# Altium schematic sheet Relay.SchDoc
size A4
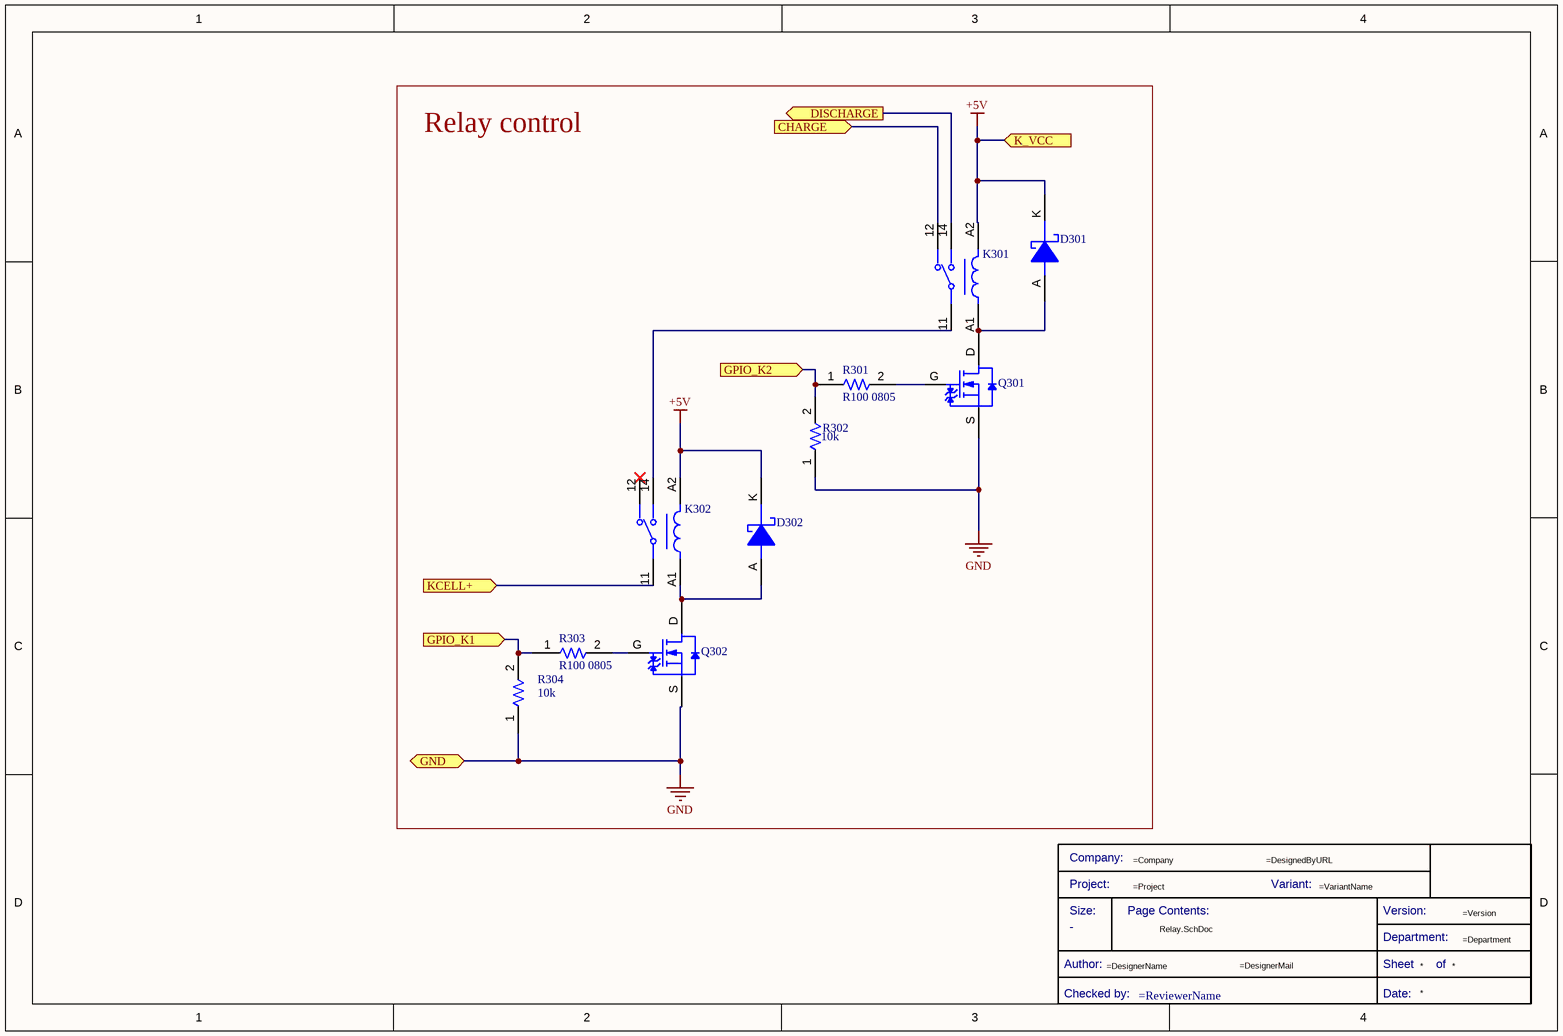
[diagram p0: Relay.SchDoc]

## Parts
*  Title Block_template  (value not drawn)  (graphical)
D301  DSC-0.5/30-SOD123  [DSC-SOD123]  (value not drawn)
D302  DSC-0.5/30-SOD123  [DSC-SOD123]  (value not drawn)
K301  Relay_RZ01-1C4-D005  [FP-1415899-7-MFG]  (value not drawn)
K302  Relay_RZ01-1C4-D005  [FP-1415899-7-MFG]  (value not drawn)
Q301  SQ2318CES-T1_GE3  [SOT95P245X110-3N]  (value not drawn)
Q302  SQ2318CES-T1_GE3  [SOT95P245X110-3N]  (value not drawn)
R301  R100 0805  [R0805FTK]
R302  value 10k  [R0805FTK]  (hidden comment: R10k-0805FTK)
R303  R100 0805  [R0805FTK]
R304  value 10k  [R0805FTK]  (hidden comment: R10k-0805FTK)

## Blocks framed on the sheet
Relay control: D301 D302 K301 K302 Q301 Q302 R301-R304

## Ports
CHARGE (in), DISCHARGE (out), GND (bidir), GPIO_K1 (in), GPIO_K2 (in), K_VCC (in), KCELL+ (in)

## Nets
+5V: D301.K D302.K K301.A2 K302.A2 ; port K_VCC
GND: Q301.S Q302.S R302.1 R304.1 ; port GND
CHARGE: K301.12 ; port CHARGE
DISCHARGE: K301.14 ; port DISCHARGE
GPIO_K1: R303.1 R304.2 ; port GPIO_K1
GPIO_K2: R301.1 R302.2 ; port GPIO_K2
KCELL+: K302.11 ; port KCELL+
NetD301_A: D301.A K301.A1 Q301.D
NetD302_A: D302.A K302.A1 Q302.D
NetK301_11: K301.11 K302.14
NetQ301_G: Q301.G R301.2
NetQ302_G: Q302.G R303.2

Not connected (* = marked no-connect by the designer): K302 12*

## Notes on the sheet
- (in symbol Title Block_template) Company:; Project:; Variant:; Size:; Page Contents:; Version:; Department:; Author:; Sheet; of; Checked by:; Date:

## Library data of the parts
* = Title Block_template: Standard Title Block; .Creator: GP; Category: Title Block; .PCBcheck: GP; .SCHcheck: GP; Checked by:: =ReviewerName; Size: -
D301 D302 = CMP-00165-2: VR=30V IF=500mA 30pF P=410mW; Peak Non-Repetitive Surge Current: 5.5A; .Creator: GP; Voltage Rating (DC): 30V; Current Rating: 500mA; Max Reverse Leakage Current: 130uA; Element Configuration: Single; Polarity: Standard; Forward Voltage: 430mV; ComponentLink5Description: https://datasheet.ciiva.com/910/mbr0530-910516.pdf?src-supplier=Digi-Key; ComponentLink2Description: Where buy it; ComponentLink1Description: Datasheet; Pricing 1: 1=0,34400, 10=0,23900, 100=0,12200, 500=0,10000 (USD); ComponentLink7Description: https://datasheet.ciiva.com/8300/mbr0530-8300905.pdf?src-supplier=Avnet; ComponentLink3URL: https://datasheet.ciiva.com/30479/0900766b810e2512-30479401.pdf?src-supplier=RSComponents; Stock 1: 9; Max Reverse Voltage (DC): 30V; Max Repetitive Reverse Voltage (Vrrm): 30V; Width: 1.6mm; ComponentLink6URL: https://datasheet.ciiva.com/25931/mbr0530-25931989.pdf?src-supplier=Avnet+Europe; Contact Plating: Tin,Matte; Height: 1.03mm; Category: Diode; ComponentLink1URL: *; Max Surge Current: 5.5A; ComponentLink4URL: https://datasheet.ciiva.com/34301/974753-34301826.pdf?src-supplier=Jameco; ComponentLink4Description: https://datasheet.ciiva.com/34301/974753-34301826.pdf?src-supplier=Jameco; ComponentLink5URL: https://datasheet.ciiva.com/910/mbr0530-910516.pdf?src-supplier=Digi-Key; Length: 2.7mm; ComponentLink10URL: https://datasheet.ciiva.com/910/mbr0530-910518.pdf?src-supplier=Digi-Key; ComponentLink2URL: *; ComponentLink7URL: https://datasheet.ciiva.com/8300/mbr0530-8300905.pdf?src-supplier=Avnet; Max Forward Surge Current (Ifsm): 5.5A; Design Item ID: DSC-0.5/30-SOD123; REACH SVHC: No SVHC; Package Quantity: 1; RoHS Compliant: Yes; Lead Free: Lead Free; Max Reverse Current: 130uA; ComponentLink8Description: https://datasheet.ciiva.com/17318/mbr0530-17318568.pdf?src-supplier=Future+Electronics; Series: -; Average Rectified Current: 500mA; Source: Filter components.SchLib; Output Current: 500mA; ComponentLink9URL: https://datasheet.ciiva.com/15144/getdatasheetpartid-86760-15144598.pdf?src-supplier=Verical; Weight: 0.03g; ComponentLink6Description: https://datasheet.ciiva.com/25931/mbr0530-25931989.pdf?src-supplier=Avnet+Europe; ComponentLink9Description: https://datasheet.ciiva.com/15144/getdatasheetpartid-86760-15144598.pdf?src-supplier=Verical; Mount: Surface Mount; ComponentLink3Description: https://datasheet.ciiva.com/30479/0900766b810e2512-30479401.pdf?src-supplier=RSComponents; Forward Current: 500mA; Radiation Hardening: No; ComponentLink8URL: https://datasheet.ciiva.com/17318/mbr0530-17318568.pdf?src-supplier=Future+Electronics; ComponentLink10Description: https://datasheet.ciiva.com/910/mbr0530-910518.pdf?src-supplier=Digi-Key
K301 K302 = CMP-00028-00000-1: Power/Signal Relay, SPDT, Momentary, 0.084A (Coil), 5VDC (Coil), 420mW (Coil), DC Input, AC Output, Through Hole-Straight Mount. 1415899-7. RZ01-1C4-D005; RoHS Compliant: Yes; Mounting Technology: Through Hole; Max Operating Temperature: 85°C; Min Operating Temperature: -40°C
Q301 Q302 = CMP-013-00002-1: Mosfet, N-channel, 40V, 7A, SOT-23 Rohs Compliant: Yes
R301 R303 = CMP-00083-2: Res Thick Film 0805 100 Ohm 1% 1/8W ±100ppm/°C Molded SMD SMD Paper Tape on Plastic Reel; Manufacturer Part Number 1: CR0805-FX-1000ELF; Manufacturer 1: Bourns; Max Power Dissipation: 125mW; Voltage Rating: 150V; .Creator: DR; Value: 100; Height: 0.5mm; Number of Terminations: 2; ComponentLink4URL: https://datasheet.ciiva.com/6547/chpreztr-6547415.pdf?src-supplier=Digi-Key; Stock 1: 49802; Source: Passives.SchLib; ComponentLink1Description: https://datasheet.ciiva.com/11809/0900766b80fcdb72-11809178.pdf?src-supplier=RSComponents; ComponentLink3URL: https://datasheet.ciiva.com/6547/chpreztr-6547414.pdf?src-supplier=Digi-Key; Packaging: Tape and Reel; Max Operating Temperature: 155°C; REACH SVHC: No SVHC; Radiation Hardening: No; Package Quantity: 1; Min Operating Temperature: -55°C; Temperature Coefficient: 100ppm/°C; Technology: THICK FILM; Thickness: 508um; Tolerance: 1%; Resistance Tolerance: 1%; Design Item ID: R100-0805FTK; Pricing 1: 1=0,05840, 10=0,03430, 25=0,01780, 100=0,00750, 250=0,00560, 500=0,00490, 3000=0,00470 (USD); Construction: Rectangular; Power Rating: 125mW; Resistor Type: Thick Film; Case/Package: 0805; Features: Moisture Resistant; RoHS: Yes; Contact Plating: Tin; Length: 2mm; Termination: SMD/SMT; RoHS Compliant: Yes; ComponentLink2Description: https://datasheet.ciiva.com/6547/chpreztr-6547413.pdf?src-supplier=Digi-Key; ComponentLink3Description: https://datasheet.ciiva.com/6547/chpreztr-6547414.pdf?src-supplier=Digi-Key; Mount: Surface Mount; Category: Chip SMD Resistors; ComponentLink5Description: https://datasheet.ciiva.com/9120/chpreztr-9120744.pdf?src-supplier=Avnet; Case Code (Metric): 2012; Width: 1.25mm; ComponentLink1URL: https://datasheet.ciiva.com/11809/0900766b80fcdb72-11809178.pdf?src-supplier=RSComponents; Depth: 1.25mm; Voltage Rating (DC): 150V; Military Standard: Not; Series: CR0805; ComponentLink2URL: https://datasheet.ciiva.com/6547/chpreztr-6547413.pdf?src-supplier=Digi-Key; Pins: 2; ComponentLink4Description: https://datasheet.ciiva.com/6547/chpreztr-6547415.pdf?src-supplier=Digi-Key; ComponentLink5URL: https://datasheet.ciiva.com/9120/chpreztr-9120744.pdf?src-supplier=Avnet
R302 R304 = CMP-00085-4: BOURNS         CR0805-JW-103ELF            Surface Mount Chip Resistor, Thick Film, CR Series, 10 kohm, 125 mW,  5%, 150 V; Voltage Rating: 150V; Voltage Rating (DC): 100V; Max Power Dissipation: 125mW; Temperature Coefficient: 200ppm/°C; .Creator: DR; Depth: 1.25mm; Package Quantity: 1; ComponentLink6Description: https://datasheet.ciiva.com/16783/70154685-16783482.pdf?src-supplier=Allied+Electronics; Max Operating Temperature: 155°C; ComponentLink8Description: https://datasheet.ciiva.com/6559/chpreztr-6559900.pdf?src-supplier=Digi-Key; ComponentLink3URL: https://datasheet.ciiva.com/22693/1902866-22693254.pdf?src-supplier=Element14; ComponentLink2URL: https://datasheet.ciiva.com/9122/chpreztr-9122374.pdf?src-supplier=Avnet; REACH SVHC: No SVHC; ComponentLink9Description: https://datasheet.ciiva.com/6559/chpreztr-6559901.pdf?src-supplier=Digi-Key; ComponentLink1URL: https://datasheet.ciiva.com/11821/0900766b80fcdb72-11821135.pdf?src-supplier=RSComponents; Manufacturer Part Number 1: CR0805-JW-103ELF; ComponentLink8URL: https://datasheet.ciiva.com/6559/chpreztr-6559900.pdf?src-supplier=Digi-Key; Length: 2mm; ComponentLink10Description: https://datasheet.ciiva.com/7985/1856384-7985869.pdf?src-supplier=Element14; Case/Package: 0805; ComponentLink5Description: https://datasheet.ciiva.com/30065/159chpreztr-30065976.pdf?src-supplier=Onlinecomponents.com; Design Item ID: R10k-0805FTK; ComponentLink1Description: https://datasheet.ciiva.com/11821/0900766b80fcdb72-11821135.pdf?src-supplier=RSComponents; Number of Terminations: 2; Radiation Hardening: No; Resistance Tolerance: 5%; ComponentLink4Description: https://datasheet.ciiva.com/7986/691949-7986187.pdf?src-supplier=Element14; ComponentLink3Description: https://datasheet.ciiva.com/22693/1902866-22693254.pdf?src-supplier=Element14; Packaging: Tape and Reel; ComponentLink6URL: https://datasheet.ciiva.com/16783/70154685-16783482.pdf?src-supplier=Allied+Electronics; Pins: 2; ComponentLink5URL: https://datasheet.ciiva.com/30065/159chpreztr-30065976.pdf?src-supplier=Onlinecomponents.com; Mount: Surface Mount; ComponentLink11URL: https://datasheet.ciiva.com/48692/001055517-da-01-en-smd-wid-cr0805-jw-103elf-10k-ohm-1-8w-48692118.pdf?src-supplier=Conrad; ComponentLink11Description: https://datasheet.ciiva.com/48692/001055517-da-01-en-smd-wid-cr0805-jw-103elf-10k-ohm-1-8w-48692118.pdf?src-supplier=Conrad; Military Standard: Not; Power Rating: 125mW; Thickness: 508um; Source: Passives.SchLib; Min Operating Temperature: -55°C; Manufacturer 1: Bourns; Resistor Type: Thick Film; ComponentLink7URL: https://datasheet.ciiva.com/5548/chpreztr-5548491.pdf?src-supplier=Mouser; ComponentLink2Description: https://datasheet.ciiva.com/9122/chpreztr-9122374.pdf?src-supplier=Avnet; Termination: SMD/SMT; Features: Moisture Resistant; ComponentLink4URL: https://datasheet.ciiva.com/7986/691949-7986187.pdf?src-supplier=Element14; RoHS Compliant: Yes; ComponentLink9URL: https://datasheet.ciiva.com/6559/chpreztr-6559901.pdf?src-supplier=Digi-Key; Technology: THICK FILM; ComponentLink10URL: https://datasheet.ciiva.com/7985/1856384-7985869.pdf?src-supplier=Element14; Height: 0.5mm; Category: Chip SMD Resistors; RoHS: Yes; Series: CR0805; Pricing 1: 1=0,05790, 10=0,01540, 25=0,01340, 100=0,00340 (USD); Stock 1: 57566; ComponentLink7Description: https://datasheet.ciiva.com/5548/chpreztr-5548491.pdf?src-supplier=Mouser; Case Code (Metric): 2012; Contact Plating: Tin; Tolerance: 5%; Construction: Rectangular; Width: 1.25mm